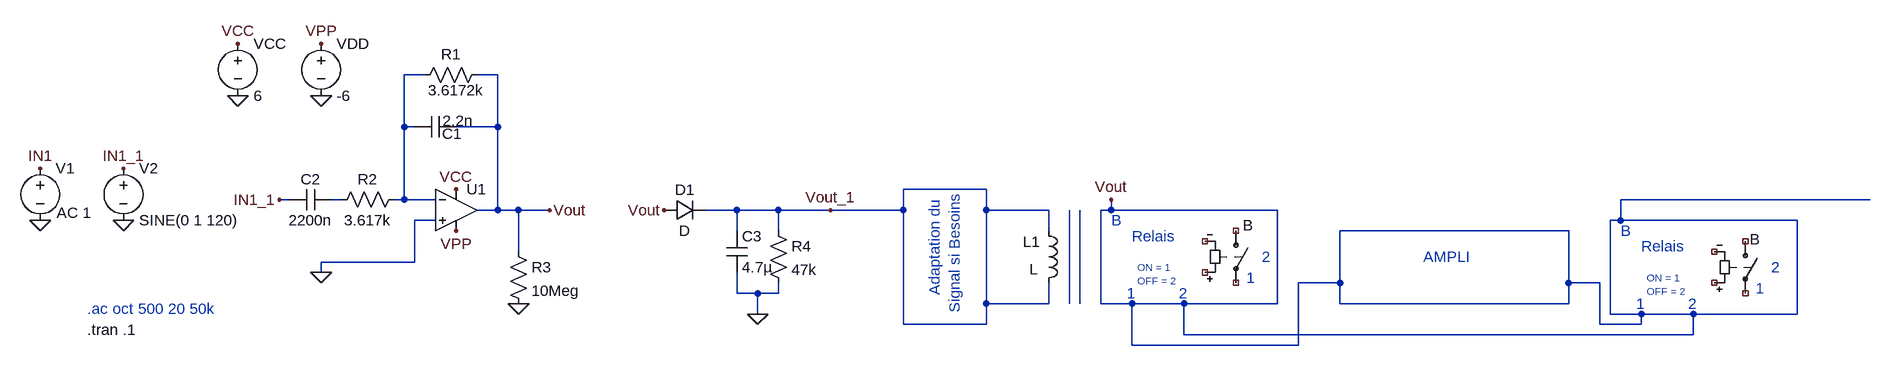
[diagram p0: schematic Circuit_Analog.asc]
Circuit_Analog.asc, the LTspice schematic file:
Version 4
SHEET 1 3580 680
WIRE 256 -80 224 -80
WIRE 368 -80 336 -80
WIRE 224 0 224 -80
WIRE 240 0 224 0
WIRE 368 0 368 -80
WIRE 368 0 304 0
WIRE 1120 96 992 96
WIRE 48 112 32 112
WIRE 128 112 112 112
WIRE 224 112 224 0
WIRE 224 112 208 112
WIRE 272 112 224 112
WIRE 2480 112 2096 112
WIRE 368 128 368 0
WIRE 368 128 336 128
WIRE 400 128 368 128
WIRE 448 128 400 128
WIRE 736 128 688 128
WIRE 800 128 736 128
WIRE 880 128 800 128
WIRE 992 128 992 96
WIRE 992 128 880 128
WIRE 1120 128 1120 96
WIRE 1216 128 1120 128
WIRE 1312 128 1312 112
WIRE 1312 128 1296 128
WIRE 1568 128 1312 128
WIRE 272 144 240 144
WIRE 2096 144 2096 112
WIRE 2096 144 2080 144
WIRE 2368 144 2096 144
WIRE 736 160 736 128
WIRE 800 160 800 128
WIRE 1216 160 1216 128
WIRE 2016 160 1664 160
WIRE 400 192 400 128
WIRE 240 208 240 144
WIRE 240 208 96 208
WIRE 96 224 96 208
WIRE 1664 240 1664 160
WIRE 1664 240 1600 240
WIRE 2016 240 2016 160
WIRE 2064 240 2016 240
WIRE 736 256 736 224
WIRE 768 256 736 256
WIRE 800 256 800 240
WIRE 800 256 768 256
WIRE 1120 272 1120 128
WIRE 1216 272 1216 240
WIRE 1216 272 1120 272
WIRE 1248 272 1248 128
WIRE 1264 272 1264 128
WIRE 1296 272 1296 128
WIRE 1344 272 1296 272
WIRE 1424 272 1344 272
WIRE 1568 272 1568 128
WIRE 1568 272 1424 272
WIRE 1664 272 1664 240
WIRE 2016 272 2016 240
WIRE 2016 272 1664 272
WIRE 768 288 768 256
WIRE 2080 288 2080 144
WIRE 2128 288 2080 288
WIRE 2208 288 2128 288
WIRE 2368 288 2368 144
WIRE 2368 288 2208 288
WIRE 992 304 992 128
WIRE 1120 304 1120 272
WIRE 1120 304 992 304
WIRE 2064 304 2064 240
WIRE 2128 304 2128 288
WIRE 2128 304 2064 304
WIRE 1424 320 1424 272
WIRE 2208 320 2208 288
WIRE 2208 320 1424 320
WIRE 1344 336 1344 272
WIRE 1600 336 1600 240
WIRE 1600 336 1344 336
FLAG -336 144 0
FLAG -336 64 IN1
FLAG -32 -48 0
FLAG 96 -48 0
FLAG -32 -128 VCC
FLAG 96 -128 VPP
FLAG 304 96 VCC
FLAG 304 160 VPP
FLAG 96 224 0
FLAG 448 128 Vout
FLAG 400 272 0
FLAG 624 128 Vout
FLAG 768 288 0
FLAG -208 64 IN1_1
FLAG 32 112 IN1_1
FLAG -208 144 0
FLAG 880 128 Vout_1
FLAG 1312 112 Vout
SYMBOL voltage -336 48 R0
WINDOW 3 25 84 Left 2
WINDOW 123 0 0 Left 0
WINDOW 39 0 0 Left 0
SYMATTR Value AC 1
SYMATTR InstName V1
SYMBOL OpAmps\\UniversalOpAmp 304 128 R0
SYMATTR InstName U1
SYMBOL res 224 96 R90
WINDOW 0 0 56 VBottom 2
WINDOW 3 32 56 VTop 2
SYMATTR InstName R2
SYMATTR Value 3.617k
SYMBOL voltage -32 -144 R0
WINDOW 123 0 0 Left 0
WINDOW 39 0 0 Left 0
SYMATTR InstName VCC
SYMATTR Value 6
SYMBOL voltage 96 -144 R0
WINDOW 123 0 0 Left 0
WINDOW 39 0 0 Left 0
SYMATTR InstName VDD
SYMATTR Value -6
SYMBOL cap 112 96 R90
WINDOW 0 0 32 VBottom 2
WINDOW 3 32 32 VTop 2
SYMATTR InstName C2
SYMATTR Value 2200n
SYMBOL cap 304 -16 R90
WINDOW 0 42 6 VBottom 2
WINDOW 3 -9 -3 VTop 2
SYMATTR InstName C1
SYMATTR Value 2.2n
SYMBOL res 352 -96 R90
WINDOW 0 0 56 VBottom 2
WINDOW 3 24 48 VTop 2
SYMATTR InstName R1
SYMATTR Value 3.6172k
SYMBOL res 384 176 R0
SYMATTR InstName R3
SYMATTR Value 10Meg
SYMBOL res 784 144 R0
SYMATTR InstName R4
SYMATTR Value 47k
SYMBOL cap 720 160 R0
SYMATTR InstName C3
SYMATTR Value 4.7µ
SYMBOL diode 624 144 R270
WINDOW 0 32 32 VTop 2
WINDOW 3 0 32 VBottom 2
SYMATTR InstName D1
SYMBOL voltage -208 48 R0
WINDOW 123 0 0 Left 0
WINDOW 39 0 0 Left 0
SYMATTR InstName V2
SYMATTR Value SINE(0 1 120)
SYMBOL ind 1200 144 R0
WINDOW 0 -24 33 Left 2
WINDOW 3 -14 75 Left 2
SYMATTR InstName L1
SYMBOL sw 2288 160 R0
WINDOW 0 7 13 Left 2
SYMATTR InstName B
SYMATTR Value ""
SYMBOL sw 1504 144 R0
WINDOW 0 11 7 Left 2
SYMATTR InstName B
SYMATTR Value ""
TEXT -264 280 Left 2 ;.ac oct 500 20 50k
TEXT -264 312 Left 2 !.tran .1
TEXT 1040 104 VRight 2 ;Adaptation du \nSignal si Besoins
TEXT 1792 200 Left 2 ;AMPLI
TEXT 1344 168 Left 2 ;Relais
TEXT 1336 256 Left 2 ;1
TEXT 1416 256 Left 2 ;2
TEXT 1352 216 Left 1 ;ON = 1\nOFF = 2
TEXT 2128 184 Left 2 ;Relais
TEXT 2120 272 Left 2 ;1
TEXT 2200 272 Left 2 ;2
TEXT 2136 232 Left 1 ;ON = 1\nOFF = 2
TEXT 2328 216 Left 2 ;2
TEXT 2304 248 Left 2 ;1
TEXT 1544 200 Left 2 ;2
TEXT 1520 232 Left 2 ;1
TEXT 1312 144 Left 2 ;B
TEXT 2096 160 Left 2 ;B

The netlist it stands for:
* Circuit_Analog.asc
V1 IN1 0 AC 1
XU1 0 N001 VCC VPP Vout level1 Avol=1Meg GBW=10Meg Vos=0 En=0 Enk=0 In=0 Ink=0 Rin=500Meg  ; pins In+ In- V+ V- OUT
R2 N001 N002 3.617k
VCC VCC 0 6
VDD VPP 0 -6
C2 N002 IN1_1 2200n
C1 Vout N001 2.2n
R1 Vout N001 3.6172k
R3 Vout 0 10Meg
R4 Vout_1 0 47k
C3 Vout_1 0 4.7µ
D1 Vout Vout_1 D
V2 IN1_1 0 SINE(0 1 120)
L1 Vout_1 Vout_1 L
S§B NC_01 NC_02 NC_03 NC_04
S§B NC_05 NC_06 NC_07 NC_08
.model D D
.lib standard.dio
* .ac oct 500 20 50k
.tran .1
* Adaptation du
* Signal si Besoins
* AMPLI
* Relais
* 1
* 2
* ON = 1
* OFF = 2
* Relais
* 1
* 2
* ON = 1
* OFF = 2
* 2
* 1
* 2
* 1
* B
* B
.lib UniversalOpAmp1.lib
.backanno
.end